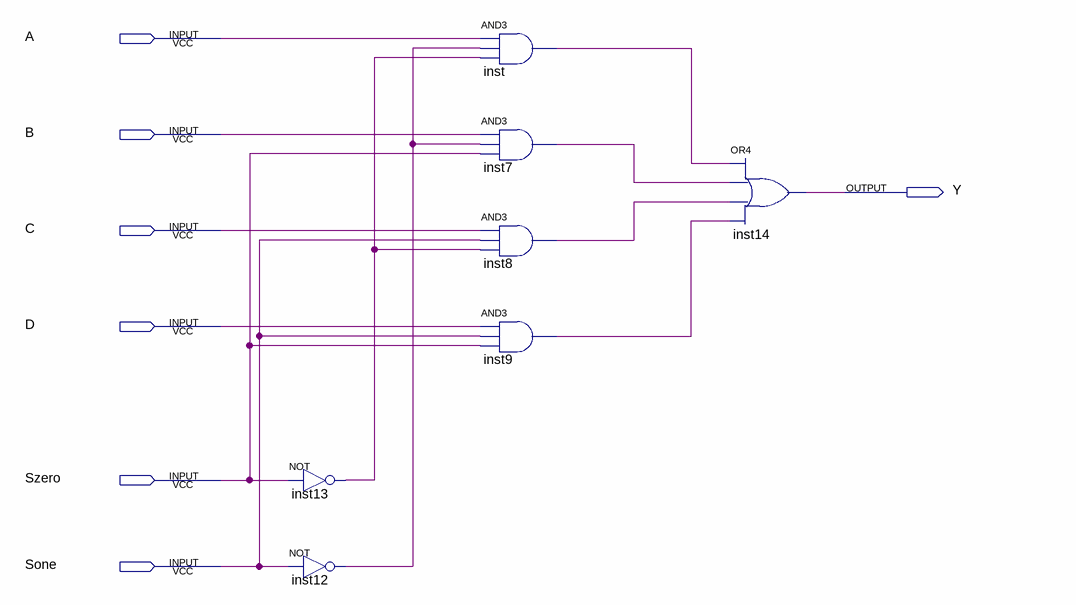
[diagram p0: schematic sheet]
// Quartus schematic SingleBitFourNumberMultiplexer.bdf as structural Verilog: 7 symbols, 7 pins
module SingleBitFourNumberMultiplexer (
  input  A,
  input  B,
  input  C,
  input  D,
  input  Szero,
  input  Sone,
  output Y
);

  wire inst7_out, inst8_out, inst9_out, inst12_out, inst13_out, inst_out;

  not inst13 (inst13_out, Szero);
  not inst12 (inst12_out, Sone);
  and inst (inst_out, A, inst12_out, inst13_out);
  and inst7 (inst7_out, B, inst12_out, Szero);
  and inst8 (inst8_out, C, Sone, inst13_out);
  and inst9 (inst9_out, D, Sone, Szero);
  or inst14 (Y, inst_out, inst7_out, inst8_out, inst9_out);
endmodule
